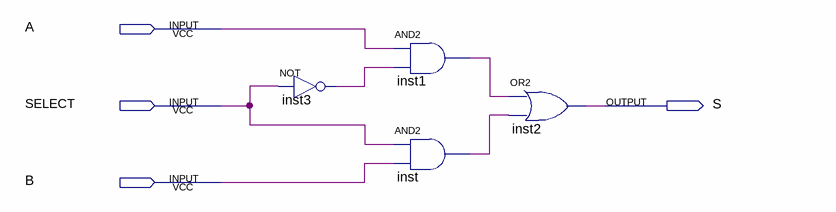
[diagram p0: schematic sheet]
// Quartus schematic MUX2x1.bdf as structural Verilog: 4 symbols, 4 pins
module MUX2x1 (
  input  A,
  input  SELECT,
  input  B,
  output S
);

  wire inst1_out, inst3_out, inst_out;

  not inst3 (inst3_out, SELECT);
  and inst1 (inst1_out, A, inst3_out);
  and inst (inst_out, SELECT, B);
  or inst2 (S, inst1_out, inst_out);
endmodule
